# EAGLE design hymera25 (EAGLE 5.07)
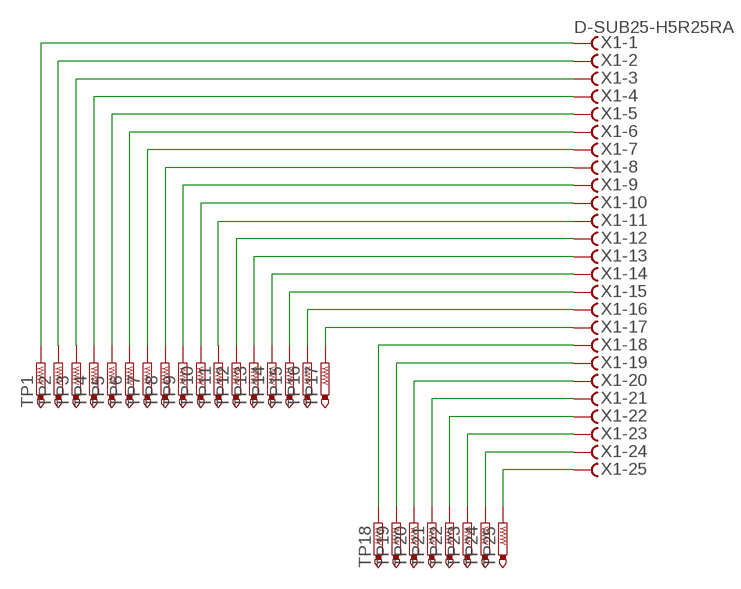
[diagram p0: schematic, sheet 1]

## Parts
TP1  PTR1PAD1-13  [P1-13]
TP2  PTR1PAD1-13  [P1-13]
TP3  PTR1PAD1-13  [P1-13]
TP4  PTR1PAD1-13  [P1-13]
TP5  PTR1PAD1-13  [P1-13]
TP6  PTR1PAD1-13  [P1-13]
TP7  PTR1PAD1-13  [P1-13]
TP8  PTR1PAD1-13  [P1-13]
TP9  PTR1PAD1-13  [P1-13]
TP10  PTR1PAD1-13  [P1-13]
TP11  PTR1PAD1-13  [P1-13]
TP12  PTR1PAD1-13  [P1-13]
TP13  PTR1PAD1-13  [P1-13]
TP14  PTR1PAD1-13  [P1-13]
TP15  PTR1PAD1-13  [P1-13]
TP16  PTR1PAD1-13  [P1-13]
TP17  PTR1PAD1-13  [P1-13]
TP18  PTR1PAD1-13  [P1-13]
TP19  PTR1PAD1-13  [P1-13]
TP20  PTR1PAD1-13  [P1-13]
TP21  PTR1PAD1-13  [P1-13]
TP22  PTR1PAD1-13  [P1-13]
TP23  PTR1PAD1-13  [P1-13]
TP24  PTR1PAD1-13  [P1-13]
TP25  PTR1PAD1-13  [P1-13]
X1  D-SUB25-H5R25RA  [H5R25RA]

## Nets
N$1: TP1.TP X1.1
N$2: TP2.TP X1.2
N$3: TP3.TP X1.3
N$4: TP4.TP X1.4
N$5: TP5.TP X1.5
N$6: TP6.TP X1.6
N$7: TP7.TP X1.7
N$8: TP8.TP X1.8
N$9: TP9.TP X1.9
N$10: TP10.TP X1.10
N$11: TP11.TP X1.11
N$12: TP12.TP X1.12
N$13: TP13.TP X1.13
N$14: TP14.TP X1.14
N$15: TP15.TP X1.15
N$16: TP16.TP X1.16
N$17: TP17.TP X1.17
N$18: TP18.TP X1.18
N$19: TP19.TP X1.19
N$20: TP20.TP X1.20
N$21: TP21.TP X1.21
N$22: TP22.TP X1.22
N$23: TP23.TP X1.23
N$24: TP24.TP X1.24
N$25: TP25.TP X1.25

## Library data of the parts
TP1-TP25 = matt testpad:PTR1: TEST PIN
X1 = con-thomas-betts:D-SUB25-: D-Subminiatur Connector Source: Electronioc Interconnects European Edition 1998

## Net classes
0 default: width 0.5 mm, drill 0.7 mm, clearance 0.5 mm

## Board
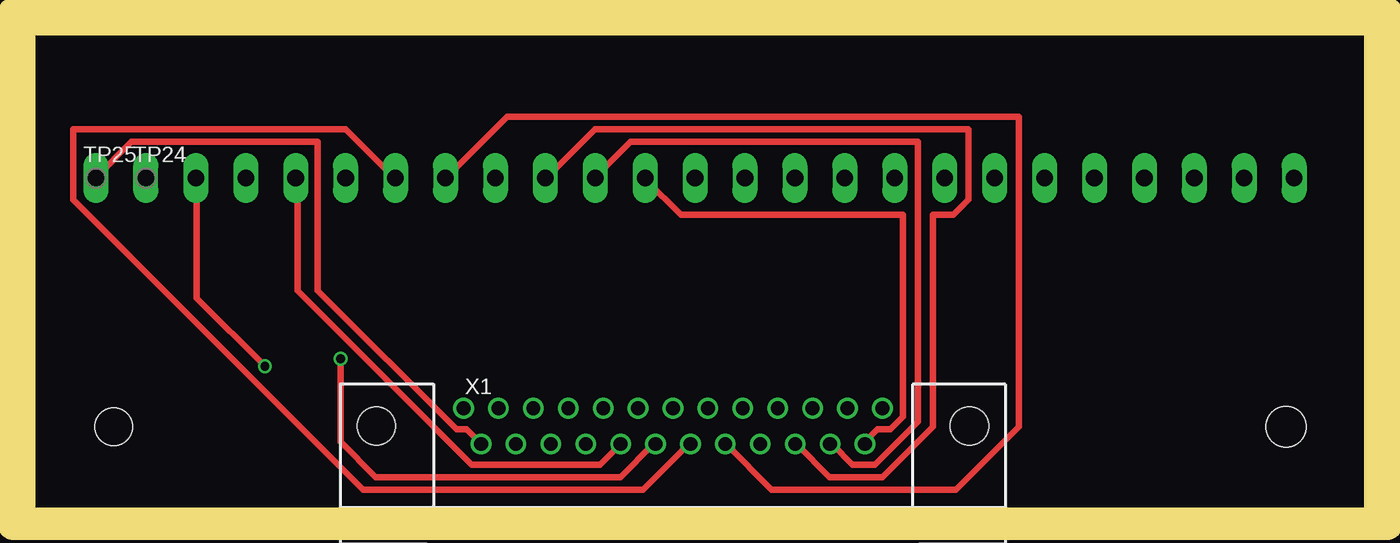
[diagram p1: board, top side]
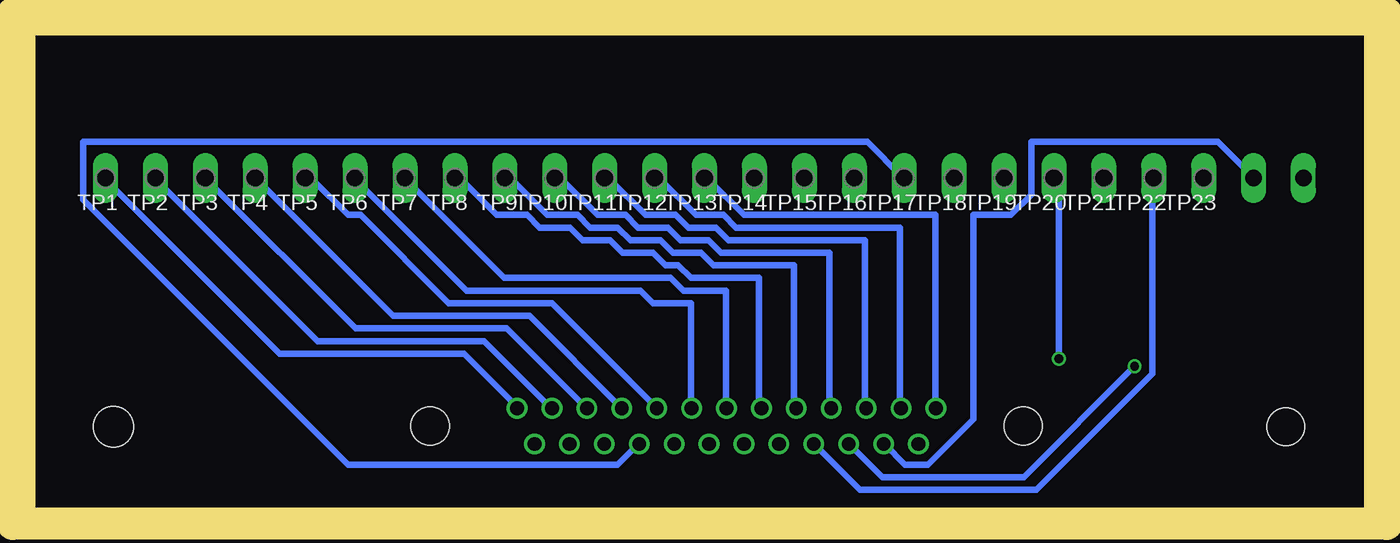
[diagram p2: board, bottom side, seen from below]

Size 106.01 x 38.04 mm. Coordinates in mm from the lower left corner, seen from the top.
Outline: 0,0 106.01,0 106.01,38.04 0,38.04 0,0
Copper layers (1*16): Top 0.035mm / dielectric 1.5mm / Bottom 0.035mm
Design rules "default *": minimum track width 0.3mm, minimum drill 24mil, track to track 8mil, track to pad 8mil, pad to pad 8mil, via to via 8mil, smd to smd 8mil, copper to edge 40mil, drill to drill 8mil, minimum pad ring 10mil, minimum via ring 8mil, stop-mask expansion 4mil, vias tented up to drill 0mil, thermal gap 10mil
Holes 3 mm at 6.51,6.7
Holes 3.2 mm at 99.51,6.7
Milling: 4 lines

### Footprints (pad centres in the part's own frame; a part is rotated, then mirrored left to right if it is on the bottom)
P1-13 = drill 1.321 pad 1.778 long: TP 0,0
H5R25RA = drill 1.092 round: 1 16.612,1.422; 2 13.843,1.422; 3 11.074,1.422; 4 8.306,1.422; 5 5.537,1.422; 6 2.769,1.422; 7 0,1.422; 8 -2.769,1.422; 9 -5.537,1.422; 10 -8.306,1.422; 11 -11.074,1.422; 12 -13.843,1.422; 13 -16.612,1.422; 14 15.227,-1.422; 15 12.459,-1.422; 16 9.69,-1.422; 17 6.921,-1.422; 18 4.153,-1.422; 19 1.384,-1.422; 20 -1.384,-1.422; 21 -4.153,-1.422; 22 -6.921,-1.422; 23 -9.69,-1.422; 24 -12.459,-1.422; 25 -15.227,-1.422 | hole 3.048: -23.52,0; 23.52,0

### Placement (x,y rotation side)
TP1  100.15,26.42 180 bottom
TP2  96.19,26.42 180 bottom
TP3  92.23,26.42 180 bottom
TP4  88.27,26.42 180 bottom
TP5  84.31,26.42 180 bottom
TP6  80.35,26.42 180 bottom
TP7  76.39,26.42 180 bottom
TP8  72.43,26.42 180 bottom
TP9  68.47,26.42 180 bottom
TP10  64.51,26.42 180 bottom
TP11  60.55,26.42 180 bottom
TP12  56.59,26.42 180 bottom
TP13  52.63,26.42 180 bottom
TP14  48.67,26.42 180 bottom
TP15  44.71,26.42 180 bottom
TP16  40.75,26.42 180 bottom
TP17  36.79,26.42 180 bottom
TP18  32.83,26.42 180 bottom
TP19  28.87,26.42 180 bottom
TP20  24.91,26.42 180 bottom
TP21  20.95,26.42 180 bottom
TP22  16.99,26.42 180 bottom
TP23  13.03,26.42 180 bottom
TP24  9.07,26.42 0 top
TP25  5.11,26.42 0 top
X1  50.88,6.75 0 top

### Tracks (layer width: path | path; a pad name or v marks a point on that pad's centre or on a via)
N$1
  Bottom 0.5: X1.1 67.51,8.3 71.71,12.5 86.31,12.5 100.11,26.3 TP1.TP
N$2
  Bottom 0.5: X1.2 64.91,8.3 70.11,13.5 83.31,13.5 96.11,26.3 TP2.TP
N$3
  Bottom 0.5: X1.3 62.11,8.3 68.31,14.5 80.31,14.5 TP3.TP
N$4
  Bottom 0.5: X1.4 59.31,8.3 66.51,15.5 77.31,15.5 88.11,26.3 TP4.TP
N$5
  Bottom 0.5: X1.5 56.51,8.3 64.71,16.5 72.91,16.5 79.91,23.5 80.91,23.5 83.71,26.3 84.31,26.3 TP5.TP
N$6
  Bottom 0.5: X1.6 53.71,8.3 53.71,16.5 56.71,16.5 57.71,17.5 71.51,17.5 80.31,26.3 TP6.TP
N$7
  Bottom 0.5: X1.7 50.91,8.3 50.91,17.5 54.31,17.5 55.31,18.5 68.51,18.5 76.31,26.3 TP7.TP
N$8
  Bottom 0.5: X1.8 48.31,8.3 48.31,18.5 53.71,18.5 54.71,19.5 55.71,19.5 56.71,20.5 59.11,20.5 60.11,21.5 62.31,21.5 63.31,22.5 65.71,22.5 66.71,23.5 69.11,23.5 71.91,26.3 72.31,26.3 TP8.TP
N$9
  Bottom 0.5: X1.9 45.51,8.3 45.51,19.5 51.91,19.5 52.91,20.5 55.11,20.5 56.11,21.5 58.51,21.5 59.51,22.5 61.71,22.5 62.71,23.5 65.11,23.5 67.91,26.3 68.31,26.3 TP9.TP
N$10
  Bottom 0.5: X1.10 42.71,8.3 42.71,20.5 51.31,20.5 52.31,21.5 54.51,21.5 55.51,22.5 57.91,22.5 58.91,23.5 61.11,23.5 63.91,26.3 64.51,26.3 TP10.TP
N$11
  Bottom 0.5: X1.11 39.91,8.3 39.91,21.5 50.71,21.5 51.71,22.5 53.91,22.5 54.91,23.5 57.31,23.5 60.11,26.3 60.51,26.3 TP11.TP
N$12
  Bottom 0.5: X1.12 37.11,8.3 37.11,22.5 50.11,22.5 51.11,23.5 53.31,23.5 56.11,26.3 56.51,26.3 TP12.TP
N$13
  Bottom 0.5: X1.13 34.31,8.3 34.31,23.5 49.51,23.5 52.31,26.3 52.51,26.3 TP13.TP
N$14
  Top 0.5: X1.14 66.11,5.5 67.11,6.5 68.11,6.5 69.11,7.5 69.11,23.5 51.51,23.5 48.71,26.3 TP14.TP
N$15
  Top 0.5: X1.15 63.51,5.3 65.11,3.7 66.91,3.7 70.31,7.1 70.31,29.3 47.51,29.3 44.71,26.5 TP15.TP
N$16
  Top 0.5: X1.16 60.71,5.3 63.31,2.7 67.51,2.7 71.51,6.7 71.51,23.5 73.11,23.5 74.31,24.7 74.31,30.3 44.71,30.3 40.91,26.5 TP16.TP
N$17
  Bottom 0.5: X1.17 57.91,5.3 59.51,3.7 80.91,3.7 101.91,24.7 101.91,29.3 39.71,29.3 36.91,26.5 TP17.TP
N$18
  Top 0.5: X1.18 55.11,5.3 58.71,1.7 73.31,1.7 78.31,6.7 78.31,31.3 37.71,31.3 TP18.TP
N$19
  Top 0.5: X1.19 52.11,5.3 48.51,1.7 26.31,1.7 3.31,24.7 3.31,30.3 24.91,30.3 28.71,26.5 TP19.TP
N$20  (via drill 0.7)
  Top 0.5: v24.51,12.1 24.51,5.5 27.31,2.7 46.71,2.7 49.31,5.3 X1.20
  Bottom 0.5: v24.51,12.1 24.51,26.3 24.91,26.3 TP20.TP
N$21
  Top 0.5: X1.21 46.71,5.3 45.11,3.7 34.91,3.7 21.11,17.5 21.11,26.3 TP21.TP
N$22
  Bottom 0.5: X1.22 43.91,5.3 40.31,1.7 26.31,1.7 17.11,10.9 17.11,26.3 TP22.TP
N$23  (via drill 0.7)
  Top 0.5: v18.51,11.5 13.11,16.9 13.11,26.3 TP23.TP
  Bottom 0.5: v18.51,11.5 27.31,2.7 38.51,2.7 41.11,5.3 X1.23
N$24
  Bottom 0.5: X1.24 38.31,5.3 36.71,3.7 34.91,3.7 31.31,7.3 31.31,23.5 28.31,23.5 26.71,25.1 26.71,29.3 11.91,29.3 9.11,26.5 TP24.TP
N$25
  Top 0.5: X1.25 35.51,5.5 34.51,6.5 33.71,6.5 22.71,17.5 22.71,29.3 7.91,29.3 5.11,26.5 TP25.TP